# Altium schematic sheet InputDriver.SchDoc
size A
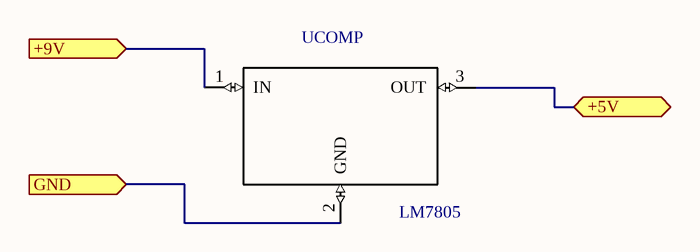
[diagram p0: InputDriver.SchDoc]

## Parts
UCOMP  LM7805  [TO-220 V]

## Ports
+5V, +9V (in), GND (in)

## Nets
+5V: UCOMP.3(OUT) ; port +5V
+9V: UCOMP.1(IN) ; port +9V
GND: UCOMP.2(GND) ; port GND

## Library data of the parts
UCOMP = LM7805: MF: Texas Instruments; Package: TO-220 Texas Instruments; Availability: Unavailable; MP: LM7805; SnapEDA_Link: https://www.snapeda.com/parts/LM7805/Texas%20Instruments/view-part/?ref=snap; Price: None; Value: *